# Altium schematic sheet Example 1.SchDoc
size A
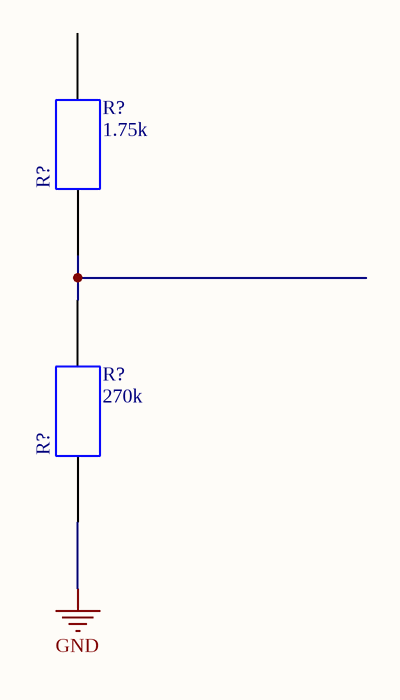
[diagram p0: Example 1.SchDoc]

## Parts
(Parts that share a designator on the sheet are numbered #1, #2 ... from top to bottom, then left to right.)
R?#1  1.75k  [R0402]
R?#2  270k  [R0402]

## Nets
GND: R?#2.0
NetR?#1_0: R?#1.0 R?#2.1

Not connected (* = marked no-connect by the designer): R?#1 1

## Library data of the parts
R?#1 = RC0402FR-071K74L: Thick Film Resistors - SMD 1.74K OHM 1%; pin to pad: 0>2; Manufacturer: Yageo; Resistance: 1.74kR; Temperature Coefficient: 100ppm/°C; Power Rating: 62.5mW; Voltage Rating: 50V; Max Power Dissipation: 63mW; Supplier 1: Digi-Key; Supplier Part Number 1: YAG3046CT-ND; Manufacturer Part Number: RC0402FR-071K74L; RoHS: Yes; Category: Chip SMD Resistors; Stock 1: 2832303; Pricing 1: 1=0.10000, 10=0.01400, 100=0.00580, 1000=0.00260, 2500=0.00226, 5000=0.00186 (USD); Case/Package: 0402; Contact Plating: Tin,Matte; Case Code (Imperial): 0402; Case Code (Metric): 1005; Min Operating Temperature: -55°C; Max Operating Temperature: 155°C; Tolerance: 1%; Resistor Type: Thick Film; Packaging: Tape and Reel; Number of Terminations: 2; Termination: SMD/SMT; Voltage Rating (DC): 50V; Features: Moisture Resistant; Length: 1mm; Width: 0.02inch; Height: 0.016inch; Depth: 0.5mm; Military Standard: Not; Lead Free: Lead Free; ComponentLink1URL: https://datasheet.ciiva.com/8895/pyu-rc0402-51-rohs-l-6-8895082.pdf?src-supplier=Avnet; ComponentLink1Description: https://datasheet.ciiva.com/8895/pyu-rc0402-51-rohs-l-6-8895082.pdf?src-supplier=Avnet; ComponentLink2URL: https://datasheet.ciiva.com/16856/pyu-rc0402-51-rohs-l-6-16856668.pdf?src-supplier=Avnet+Europe; ComponentLink2Description: https://datasheet.ciiva.com/16856/pyu-rc0402-51-rohs-l-6-16856668.pdf?src-supplier=Avnet+Europe; ComponentLink3URL: https://datasheet.ciiva.com/26829/getdatasheetpartid-325109-26829964.pdf?src-supplier=Verical; ComponentLink3Description: https://datasheet.ciiva.com/26829/getdatasheetpartid-325109-26829964.pdf?src-supplier=Verical; ComponentLink4URL: https://datasheet.ciiva.com/28416/pyu-rc0402-51-rohs-l-6-28416285.pdf?src-supplier=Avnet+Europe; ComponentLink4Description: https://datasheet.ciiva.com/28416/pyu-rc0402-51-rohs-l-6-28416285.pdf?src-supplier=Avnet+Europe; ComponentLink5URL: https://datasheet.ciiva.com/17419/pyu-rc0402-51-rohs-l-6-r-17419518.pdf?src-supplier=Future+Electronics; ComponentLink5Description: https://datasheet.ciiva.com/17419/pyu-rc0402-51-rohs-l-6-r-17419518.pdf?src-supplier=Future+Electronics; ComponentLink6URL: https://datasheet.ciiva.com/12560/pyu-rc0402-51-rohs-l-6-r-8721-12560831.pdf?src-supplier=Mouser; ComponentLink6Description: https://datasheet.ciiva.com/12560/pyu-rc0402-51-rohs-l-6-r-8721-12560831.pdf?src-supplier=Mouser
R?#2 = RC0402JR-07270KL: Res Thick Film 0402 270K Ohm 5% 1/16W 100ppm/C Molded SMD SMD Paper T/R; pin to pad: 0>2; Manufacturer: Yageo; Resistance: 270kR; Temperature Coefficient: 100ppm/°C; Power Rating: 63mW; Voltage Rating: 50V; Supplier 1: Digi-Key; Supplier Part Number 1: 311-270KJRCT-ND; Manufacturer Part Number: RC0402JR-07270KL; RoHS: Yes; Category: Chip SMD Resistors; Stock 1: 57764; Pricing 1: 1=0.10000, 10=0.01200, 100=0.00470, 1000=0.00212, 2500=0.00184, 5000=0.00152 (USD); Case/Package: 0402; Number of Pins: 2; Contact Plating: Tin,Matte; Case Code (Metric): 1005; Case Code (Imperial): 0402; Min Operating Temperature: -55°C; Max Operating Temperature: 155°C; Tolerance: 5%; Resistor Type: Thick Film; Voltage Rating (DC): 50V; Package Quantity: 1; Packaging: Tape and Reel; Number of Terminations: 2; Termination: SMD/SMT; Max Power Dissipation: 63mW; Working Voltage: 50V; Features: Moisture Resistant; Length: 1mm; Width: 0.5mm; Height: 0.016inch; Depth: 0.5mm; Radiation Hardening: No; REACH SVHC: No SVHC; Military Standard: Not; Lead Free: Lead Free; ComponentLink1URL: https://datasheet.ciiva.com/7850/1018594-7850182.pdf?src-supplier=Element14; ComponentLink1Description: https://datasheet.ciiva.com/7850/1018594-7850182.pdf?src-supplier=Element14; ComponentLink2URL: https://datasheet.ciiva.com/12558/pyu-rc0402-51-rohs-l-6-r-8721-12558474.pdf?src-supplier=Mouser; ComponentLink2Description: https://datasheet.ciiva.com/12558/pyu-rc0402-51-rohs-l-6-r-8721-12558474.pdf?src-supplier=Mouser; ComponentLink3URL: https://datasheet.ciiva.com/2452/pyu-r-int-thick-7-2452700.pdf?src-supplier=Digi-Key; ComponentLink3Description: https://datasheet.ciiva.com/2452/pyu-r-int-thick-7-2452700.pdf?src-supplier=Digi-Key; ComponentLink4URL: https://datasheet.ciiva.com/8886/pyu-rc0402-51-rohs-l-6-8886470.pdf?src-supplier=Avnet; ComponentLink4Description: https://datasheet.ciiva.com/8886/pyu-rc0402-51-rohs-l-6-8886470.pdf?src-supplier=Avnet; ComponentLink5URL: https://datasheet.ciiva.com/7850/1018594-7850183.pdf?src-supplier=Element14; ComponentLink5Description: https://datasheet.ciiva.com/7850/1018594-7850183.pdf?src-supplier=Element14; ComponentLink6URL: https://datasheet.ciiva.com/16740/pyu-rc0402-51-rohs-l-6-r-16740904.pdf?src-supplier=Future+Electronics; ComponentLink6Description: https://datasheet.ciiva.com/16740/pyu-rc0402-51-rohs-l-6-r-16740904.pdf?src-supplier=Future+Electronics; ComponentLink7URL: https://datasheet.ciiva.com/2452/pyu-r-int-thick-7-2452698.pdf?src-supplier=Digi-Key; ComponentLink7Description: https://datasheet.ciiva.com/2452/pyu-r-int-thick-7-2452698.pdf?src-supplier=Digi-Key; ComponentLink8URL: https://datasheet.ciiva.com/2452/pyu-r-int-thick-7-2452699.pdf?src-supplier=Digi-Key; ComponentLink8Description: https://datasheet.ciiva.com/2452/pyu-r-int-thick-7-2452699.pdf?src-supplier=Digi-Key; ComponentLink9URL: https://datasheet.ciiva.com/28392/pyu-rc0402-51-rohs-l-6-28392509.pdf?src-supplier=Avnet+Europe; ComponentLink9Description: https://datasheet.ciiva.com/28392/pyu-rc0402-51-rohs-l-6-28392509.pdf?src-supplier=Avnet+Europe